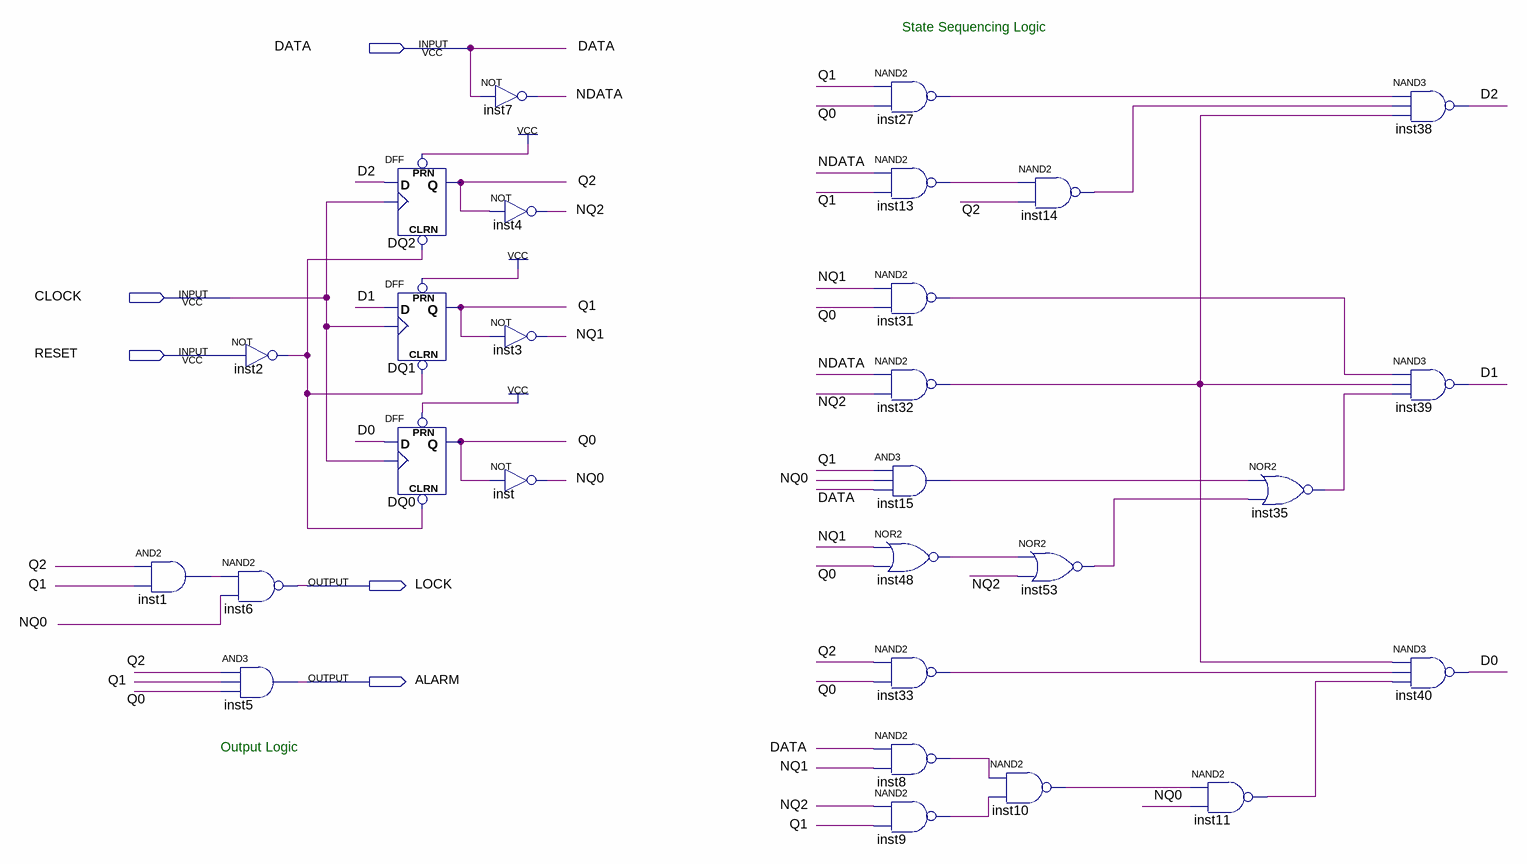
[diagram p0: schematic sheet]
// Quartus schematic dlock.bdf as structural Verilog: 28 symbols, 5 pins
module dlock (
  input  DATA,
  input  CLOCK,
  input  RESET,
  output LOCK,
  output ALARM
);

  wire D0, D1, D2, inst1_out, inst2_out, inst8_out, inst9_out, inst10_out, inst11_out, inst13_out,
       inst14_out, inst15_out, inst27_out, inst31_out, inst32_out, inst33_out, inst35_out, inst48_out,
       inst53_out, NDATA, NQ0, NQ1, NQ2, Q0, Q1, Q2;

  and inst1 (inst1_out, Q2, Q1);
  not inst2 (inst2_out, RESET);
  nand inst6 (LOCK, inst1_out, NQ0);
  and inst5 (ALARM, Q2, Q1, Q0);
  DFF DQ2 (.CLRN(inst2_out), .CLK(CLOCK), .D(D2), .PRN(1'b1), .Q(Q2));
  DFF DQ1 (.CLRN(inst2_out), .CLK(CLOCK), .D(D1), .PRN(1'b1), .Q(Q1));
  DFF DQ0 (.CLRN(inst2_out), .CLK(CLOCK), .D(D0), .PRN(1'b1), .Q(Q0));
  not inst7 (NDATA, DATA);
  not inst4 (NQ2, Q2);
  not inst3 (NQ1, Q1);
  not inst (NQ0, Q0);
  nand inst27 (inst27_out, Q1, Q0);
  nand inst13 (inst13_out, NDATA, Q1);
  nand inst31 (inst31_out, NQ1, Q0);
  nand inst32 (inst32_out, NDATA, NQ2);
  and inst15 (inst15_out, Q1, NQ0, DATA);
  nor inst48 (inst48_out, NQ1, Q0);
  nand inst33 (inst33_out, Q2, Q0);
  nand inst8 (inst8_out, DATA, NQ1);
  nand inst9 (inst9_out, NQ2, Q1);
  nand inst14 (inst14_out, inst13_out, Q2);
  nor inst53 (inst53_out, inst48_out, NQ2);
  nand inst10 (inst10_out, inst8_out, inst9_out);
  nand inst11 (inst11_out, inst10_out, NQ0);
  nor inst35 (inst35_out, inst15_out, inst53_out);
  nand inst38 (D2, inst27_out, inst14_out, inst32_out);
  nand inst39 (D1, inst31_out, inst32_out, inst35_out);
  nand inst40 (D0, inst32_out, inst33_out, inst11_out);

  // Notes on the sheet:
  //   State Sequencing Logic
  //   Output Logic
endmodule
